# Altium project TcpControl.PrjPCB
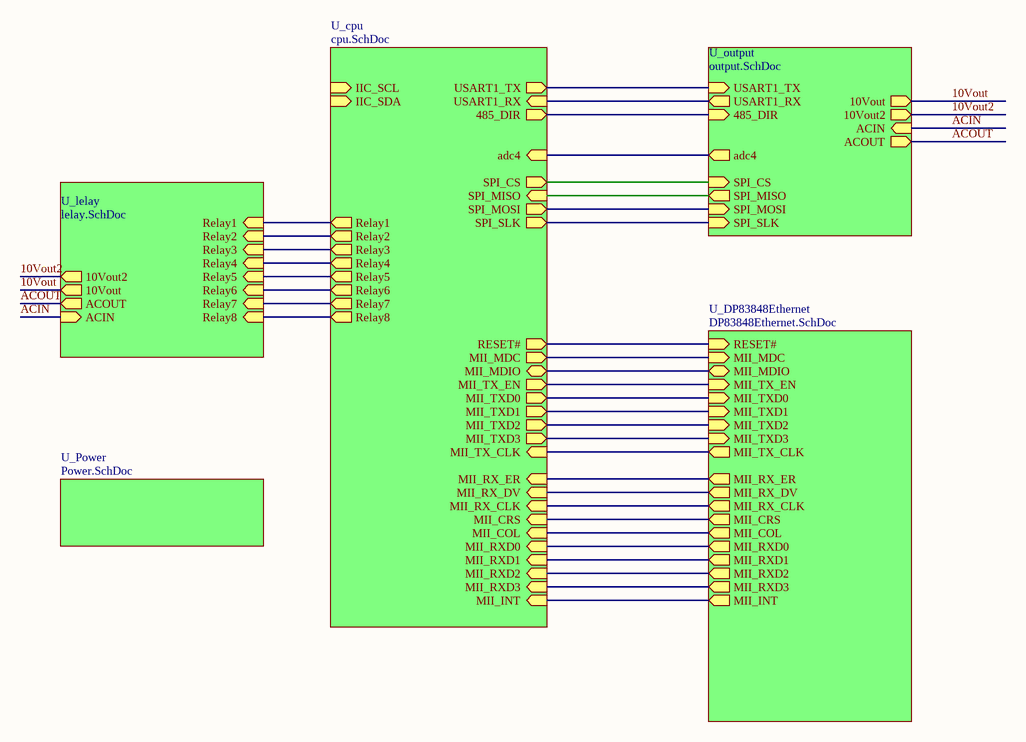
[diagram p0: tcpcontrol.SchDoc]
6 sheets, 221 parts. Net scope: hierarchical (ports join the sheet entries above them; power ports are global).
Board file: tcpcontrol.pcbdoc
Sheets:
  tcpcontrol.SchDoc
    U_cpu = cpu.SchDoc
    U_lelay = lelay.SchDoc
    U_output = output.SchDoc
    U_Power = Power.SchDoc
    U_DP83848Ethernet = DP83848Ethernet.SchDoc

## Sheet tcpcontrol.SchDoc
size A3; Organization: Altium Limited; Address1: L3, 12a Rodborough Rd; Address2: Frenchs Forest; Address3: NSW; Address4: Australia 2086

### Sub-sheets
U_cpu = cpu.SchDoc: USART1_TX (out), USART1_RX (in), Relay1 (out), Relay2 (out), 485_DIR (out), IIC_SCL (in), IIC_SDA (in), Relay3 (out), Relay4 (out), Relay8 (out), Relay7 (out), Relay5 (out), Relay6 (out), SPI_CS (out), SPI_MOSI (out), SPI_SLK (out), SPI_MISO (in), MII_TXD0 (out), MII_RX_ER (in), MII_RXD0 (in), MII_MDC (out), MII_MDIO (bidir), MII_RXD2 (in), MII_RX_DV (in), MII_TX_CLK (in), MII_TX_EN (out), MII_RXD3 (in), MII_RXD1 (in), MII_TXD3 (out), MII_INT (in), adc4 (in), RESET# (out), MII_CRS (in), MII_COL (in), MII_RX_CLK (in), MII_TXD1 (out), MII_TXD2 (out)
U_DP83848Ethernet = DP83848Ethernet.SchDoc: MII_TXD0 (in), MII_TX_EN (in), MII_TX_CLK (out), MII_RXD0 (out), MII_RX_ER (out), MII_RX_DV (out), MII_RX_CLK (out), MII_COL (out), MII_CRS (out), MII_MDC (in), MII_MDIO (bidir), RESET# (in), MII_TXD1 (in), MII_TXD2 (in), MII_TXD3 (in), MII_RXD1 (out), MII_RXD2 (out), MII_RXD3 (out), MII_INT (out)
U_lelay = lelay.SchDoc: Relay1 (in), Relay2 (in), Relay3 (in), Relay4 (in), Relay5 (in), Relay6 (in), Relay7 (in), Relay8 (in), 10Vout2 (out), 10Vout (out), ACOUT (out), ACIN (in)
U_output = output.SchDoc: USART1_TX (in), USART1_RX (out), 485_DIR (in), 10Vout2 (out), ACIN (in), ACOUT (out), 10Vout (out), SPI_CS (in), SPI_MISO (out), SPI_SLK (in), SPI_MOSI (in), adc4 (out)
U_Power = Power.SchDoc: no entries

### Nets
10Vout: sheet U_lelay/10Vout, sheet U_output/10Vout
10Vout2: sheet U_lelay/10Vout2, sheet U_output/10Vout2
ACIN: sheet U_lelay/ACIN, sheet U_output/ACIN  [project net 220_N]
ACOUT: sheet U_lelay/ACOUT, sheet U_output/ACOUT
NRST: sheet U_cpu/RESET#, sheet U_DP83848Ethernet/RESET#
PA0: sheet U_cpu/MII_CRS, sheet U_DP83848Ethernet/MII_CRS
PA1: sheet U_cpu/MII_RX_CLK, sheet U_DP83848Ethernet/MII_RX_CLK
PA2: sheet U_cpu/MII_MDIO, sheet U_DP83848Ethernet/MII_MDIO
PA3: sheet U_cpu/MII_COL, sheet U_DP83848Ethernet/MII_COL
PA4: sheet U_cpu/adc4, sheet U_output/adc4
PA5: sheet U_cpu/SPI_SLK, sheet U_output/SPI_SLK
PA6: sheet U_cpu/SPI_MISO, sheet U_output/SPI_MISO
PA7: sheet U_cpu/MII_RX_DV, sheet U_DP83848Ethernet/MII_RX_DV
PB0: sheet U_cpu/MII_RXD2, sheet U_DP83848Ethernet/MII_RXD2
PB1: sheet U_cpu/MII_RXD3, sheet U_DP83848Ethernet/MII_RXD3
PB5: sheet U_cpu/SPI_MOSI, sheet U_output/SPI_MOSI
PB6: sheet U_cpu/USART1_TX, sheet U_output/USART1_TX
PB7: sheet U_cpu/USART1_RX, sheet U_output/USART1_RX
PB8: sheet U_cpu/485_DIR, sheet U_output/485_DIR
PB10: sheet U_cpu/MII_RX_ER, sheet U_DP83848Ethernet/MII_RX_ER
PB11: sheet U_cpu/MII_TX_EN, sheet U_DP83848Ethernet/MII_TX_EN
PB12: sheet U_cpu/MII_TXD0, sheet U_DP83848Ethernet/MII_TXD0
PB13: sheet U_cpu/MII_TXD1, sheet U_DP83848Ethernet/MII_TXD1
PC1: sheet U_cpu/MII_MDC, sheet U_DP83848Ethernet/MII_MDC
PC2: sheet U_cpu/MII_TXD2, sheet U_DP83848Ethernet/MII_TXD2
PC3: sheet U_cpu/MII_TX_CLK, sheet U_DP83848Ethernet/MII_TX_CLK
PC4: sheet U_cpu/MII_RXD0, sheet U_DP83848Ethernet/MII_RXD0
PC5: sheet U_cpu/MII_RXD1, sheet U_DP83848Ethernet/MII_RXD1
PD0: sheet U_cpu/Relay5, sheet U_lelay/Relay5
PD1: sheet U_cpu/Relay6, sheet U_lelay/Relay6
PD2: sheet U_cpu/Relay7, sheet U_lelay/Relay7
PD3: sheet U_cpu/Relay8, sheet U_lelay/Relay8
PE2: sheet U_cpu/MII_TXD3, sheet U_DP83848Ethernet/MII_TXD3
PE10: sheet U_cpu/Relay4, sheet U_lelay/Relay4
PE11: sheet U_cpu/Relay3, sheet U_lelay/Relay3
PE12: sheet U_cpu/Relay2, sheet U_lelay/Relay2
PE13: sheet U_cpu/Relay1, sheet U_lelay/Relay1
PE15: sheet U_cpu/SPI_CS, sheet U_output/SPI_CS
NetR71_2: sheet U_cpu/MII_INT, sheet U_DP83848Ethernet/MII_INT

### Notes on the sheet
- Title
- Size:
- Date:
- A3
- Number:
- Time:
- Revision:
- Sheet
- of
- File:

## Sheet cpu.SchDoc
size A4
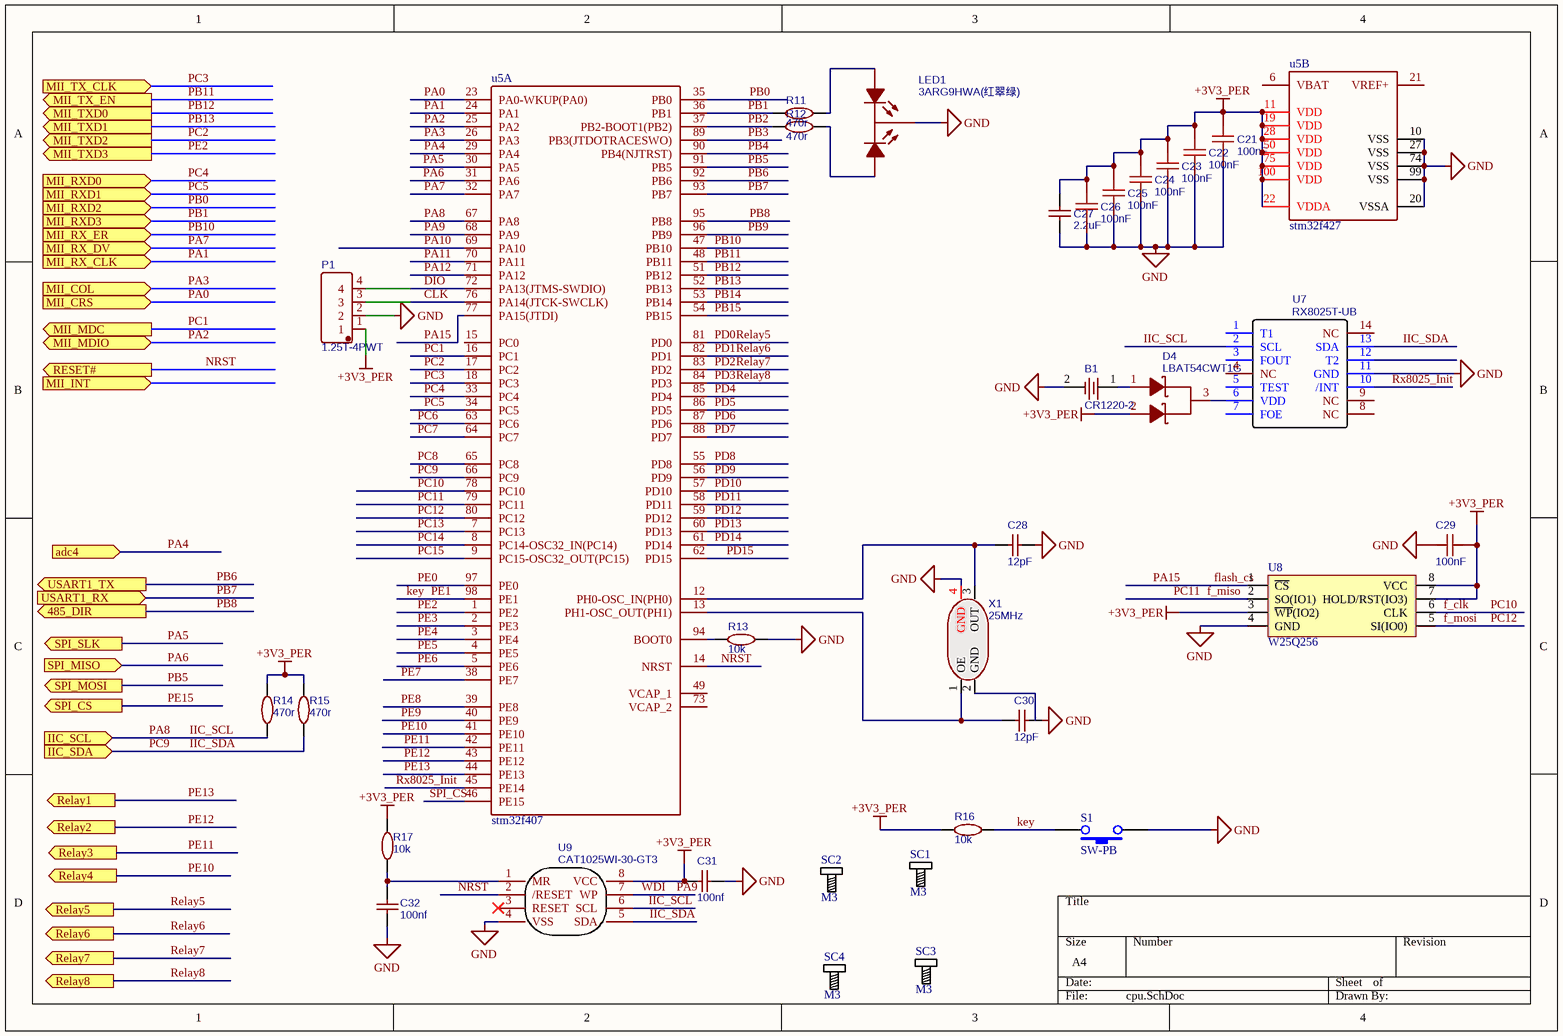
[diagram p1: cpu.SchDoc]

### Parts
B1  CR1220-2  [BATTERY-2]
C21  100nF  [0603 - cap]
C22  100nF  [0603 - cap]
C23  100nF  [0603 - cap]
C24  100nF  [0603 - cap]
C25  100nF  [0603 - cap]
C26  100nF  [0603 - cap]
C27  2.2uF  [1206 - cap]
C28  12pF  [0603 - cap]
C29  100nF  [0603 - cap]
C30  12pF  [0603 - cap]
C31  100nf  [0603 - cap]
C32  100nf  [0603 - cap]
D4  LBAT54CWT1G  [SC-70(SC-70-3)]
LED1  3ARG9HWA(红翠绿)  [led3]
P1  1.25T-4PWT  [1.25T-4PWT]
R11  470r  [0603-res]
R12  470r  [0603-res]
R13  10k  [0603-res]
R14  470r  [0603-res]
R15  470r  [0603-res]
R16  10k  [0603-res]
R17  10k  [0603-res]
S1  SW-PB  [HYA45513]
SC1  M3  [安装孔(3mm)]
SC2  M3  [安装孔(3mm)]
SC3  M3  [安装孔(3mm)]
SC4  M3  [安装孔(3mm)]
u5  stm32f407  [LQFP-100_14X14X05P]  (parts A,B of 2)
U7  RX8025T-UB  [SOP-14_208MIL]
U8  W25Q256  [LC-SOIC-8_208mil]
U9  CAT1025WI-30-GT3  [SOIC-8_150MIL]
X1  25MHz  [OSC-YSX-3225_4P]

### Ports
485_DIR (out), adc4 (in), IIC_SCL (in), IIC_SDA (in), MII_COL (in), MII_CRS (in), MII_INT (in), MII_MDC (out), MII_MDIO (bidir), MII_RX_CLK (in), MII_RX_DV (in), MII_RX_ER (in), MII_RXD0 (in), MII_RXD1 (in), MII_RXD2 (in), MII_RXD3 (in), MII_TX_CLK (in), MII_TX_EN (out), MII_TXD0 (out), MII_TXD1 (out), MII_TXD2 (out), MII_TXD3 (out), Relay1 (out), Relay2 (out), Relay3 (out), Relay4 (out), Relay5 (out), Relay6 (out), Relay7 (out), Relay8 (out), RESET# (out), SPI_CS (out), SPI_MISO (in), SPI_MOSI (out), SPI_SLK (out), USART1_RX (in), USART1_TX (out)

### Nets
+3V3_PER: C21.2 C22.2 C23.2 C24.2 C25.2 C26.2 C27.2 C29.1 C31.1 D4.2(K2) P1.1 R14.2 R15.2 R16.1 R17.2 u5.11(VDD) u5.19(VDD) u5.22(VDDA) u5.28(VDD) u5.50(VDD) u5.75(VDD) u5.100(VDD) U8.3(~{WP}(IO2)) U8.7(HOLD/RST(IO3)) U8.8(VCC) U9.8(VCC)
GND: B1.2 C21.1 C22.1 C23.1 C24.1 C25.1 C26.1 C27.1 C28.1 C29.2 C30.1 C31.2 C32.2 LED1.3(K) P1.2 R13.1 S1.1 u5.10(VSS) u5.20(VSSA) u5.27(VSS) u5.74(VSS) u5.99(VSS) U7.11(GND) U8.4(GND) U9.4(VSS) X1.4(GND)
CLK: P1.3 u5.76(PA14(JTCK-SWCLK))
DIO: P1.4 u5.72(PA13(JTMS-SWDIO))
f_clk: u5.78(PC10) U8.6(CLK)  [also labelled PC10]
f_miso: u5.79(PC11) U8.2(SO(IO1))  [also labelled PC11]
f_mosi: u5.80(PC12) U8.5(SI(IO0))  [also labelled PC12]
flash_cs: u5.77(PA15(JTDI)) U8.1(~{CS})  [also labelled PA15]
IIC_SCL: R14.1 u5.67(PA8) U7.2(SCL) U9.6(SCL) ; port IIC_SCL  [also labelled PA8]
IIC_SDA: R15.1 u5.66(PC9) U7.13(SDA) U9.5(SDA) ; port IIC_SDA  [also labelled PC9]
key: R16.2 S1.2 u5.98(PE1)  [also labelled PE1]
NRST: u5.14(NRST) U9.2(/RESET) ; port RESET#
PA0: u5.23(PA0-WKUP(PA0)) ; port MII_CRS
PA1: u5.24(PA1) ; port MII_RX_CLK
PA2: u5.25(PA2) ; port MII_MDIO
PA3: u5.26(PA3) ; port MII_COL
PA4: u5.29(PA4) ; port adc4
PA5: u5.30(PA5) ; port SPI_SLK
PA6: u5.31(PA6) ; port SPI_MISO
PA7: u5.32(PA7) ; port MII_RX_DV
PA9: u5.68(PA9) U9.7(WP)  [also labelled WDI]
PA10: u5.69(PA10)
PA11: u5.70(PA11)
PA12: u5.71(PA12)
PB0: u5.35(PB0) ; port MII_RXD2
PB1: R11.2 u5.36(PB1) ; port MII_RXD3
PB2: R12.2 u5.37(PB2-BOOT1(PB2))
PB3: u5.89(PB3(JTDOTRACESWO))
PB4: u5.90(PB4(NJTRST))
PB5: u5.91(PB5) ; port SPI_MOSI
PB6: u5.92(PB6) ; port USART1_TX
PB7: u5.93(PB7) ; port USART1_RX
PB8: u5.95(PB8) ; port 485_DIR
PB9: u5.96(PB9)
PB10: u5.47(PB10) ; port MII_RX_ER
PB11: u5.48(PB11) ; port MII_TX_EN
PB12: u5.51(PB12) ; port MII_TXD0
PB13: u5.52(PB13) ; port MII_TXD1
PB14: u5.53(PB14)
PB15: u5.54(PB15)
PC1: u5.16(PC1) ; port MII_MDC
PC2: u5.17(PC2) ; port MII_TXD2
PC3: u5.18(PC3) ; port MII_TX_CLK
PC4: u5.33(PC4) ; port MII_RXD0
PC5: u5.34(PC5) ; port MII_RXD1
PC6: u5.63(PC6)
PC7: u5.64(PC7)
PC8: u5.65(PC8)
PC13: u5.7(PC13)
PC14: u5.8(PC14-OSC32_IN(PC14))
PC15: u5.9(PC15-OSC32_OUT(PC15))
PD0: u5.81(PD0) ; port Relay5  [also labelled Relay5]
PD1: u5.82(PD1) ; port Relay6  [also labelled Relay6]
PD2: u5.83(PD2) ; port Relay7  [also labelled Relay7]
PD3: u5.84(PD3) ; port Relay8  [also labelled Relay8]
PD4: u5.85(PD4)
PD5: u5.86(PD5)
PD6: u5.87(PD6)
PD7: u5.88(PD7)
PD8: u5.55(PD8)
PD9: u5.56(PD9)
PD10: u5.57(PD10)
PD11: u5.58(PD11)
PD12: u5.59(PD12)
PD13: u5.60(PD13)
PD14: u5.61(PD14)
PD15: u5.62(PD15)
PE0: u5.97(PE0)
PE2: u5.1(PE2) ; port MII_TXD3
PE3: u5.2(PE3)
PE4: u5.3(PE4)
PE5: u5.4(PE5)
PE6: u5.5(PE6)
PE7: u5.38(PE7)
PE8: u5.39(PE8)
PE9: u5.40(PE9)
PE10: u5.41(PE10) ; port Relay4
PE11: u5.42(PE11) ; port Relay3
PE12: u5.43(PE12) ; port Relay2
PE13: u5.44(PE13) ; port Relay1
Rx8025_Init: u5.45(PE14) U7.10(/INT)
SPI_CS: u5.46(PE15)
NetB1_1: B1.1 D4.1(K1)
NetC28_2: C28.2 u5.12(PH0-OSC_IN(PH0)) X1.3(OUT)
NetC30_2: C30.2 u5.13(PH1-OSC_OUT(PH1)) X1.1(OE)
NetC32_1: C32.1 R17.1 U9.1(MR)
NetD4_3: D4.3(A) U7.6(VDD)
NetLED1_1: LED1.1(A1) R11.1
NetLED1_2: LED1.2(A2) R12.1
NetR13_2: R13.2 u5.94(BOOT0)

Not connected (* = marked no-connect by the designer): u5 6(VBAT) 15(PC0) 21(VREF+) 49(VCAP_1) 73(VCAP_2); U7 1(T1) 3(FOUT) 4(NC) 5(TEST) 7(FOE) 8(NC) 9(NC) 12(T2) 14(NC); U9 3(RESET)*; X1 2(GND)

### Library data of the parts
B1 = (no symbol name): BOM_Manufacturer: Q&J; BOM_Supplier: LCSC; BOM_Manufacturer Part: CR1220-2; BOM_LCSC: C70381; image: //image.lceda.cn/szlcsc/C70381.jpg; spicePre: B
C21-C26 C29 = (no symbol name): BOM_Manufacturer: YAGEO; BOM_Manufacturer Part: CC0603KRX7R9BB104; nameAlias: Capacitance; BOM_Supplier: LCSC; BOM_LCSC: C14663; BOM_LCSC Assembly: Yes; spicePre: C; spiceSymbolName: CC0603KRX7R9BB104
C27 = (no symbol name): BOM_Manufacturer Part: CL31B225KBHNNNE; BOM_Manufacturer: SAMSUNG; nameAlias: Capacitance; BOM_Supplier: LCSC; BOM_LCSC: C50254; BOM_LCSC Assembly: Yes; spicePre: C; spiceSymbolName: CL31B225KBHNNNE
C28 C30-C32 = (no symbol name): BOM_Manufacturer Part: CL10C120JB8NNNC; BOM_Manufacturer: SAMSUNG; nameAlias: Capacitance; BOM_Supplier: LCSC; BOM_LCSC: C38523; BOM_LCSC Assembly: Yes; spicePre: C; spiceSymbolName: CL10C120JB8NNNC
D4 = (no symbol name): BOM_Manufacturer: LRC; BOM_Supplier: LCSC; BOM_Manufacturer Part: LBAT54CWT1G; BOM_LCSC: C57891; image: //image.lceda.cn/szlcsc/C57891.jpg; spicePre: D
LED1 = (no symbol name): BOM_Manufacturer: KENTO; BOM_Supplier: LCSC; BOM_Manufacturer Part: 3ARG9HWA(红翠绿); BOM_LCSC: C72701; spicePre: L
P1 = (no symbol name): BOM_Manufacturer: BOOMELE; spicePre: X; BOM_Supplier: LCSC; BOM_LCSC: C31597; BOM_Manufacturer Part: 1.25T-4PWT
R11-R17 = (no symbol name): BOM_Manufacturer: UniOhm; BOM_Manufacturer Part: 0603WAF1001T5E; nameAlias: Value; BOM_Supplier: LCSC; BOM_LCSC: C21190; BOM_LCSC Assembly: Yes; spicePre: R; spiceSymbolName: 0603WAF1001T5E
S1 = SW-PB: 微型按键开关
SC1-SC4 = Screw_M3: Screw
u5 = stm32f427
U7 = (no symbol name): BOM_Manufacturer: EPSON; BOM_Supplier: LCSC; BOM_Manufacturer Part: RX8025T-UB; BOM_LCSC: C17353; image: //image.lceda.cn/szlcsc/C17353.jpg; spicePre: U
U8 = W25Q128
U9 = (no symbol name): BOM_Manufacturer: ON; BOM_Supplier: LCSC; BOM_Manufacturer Part: CAT1025WI-30-GT3; BOM_LCSC: C30752; image: //image.lceda.cn/szlcsc/C30752.jpg; spicePre: U
X1 = (no symbol name): BOM_Manufacturer: YXC; BOM_Manufacturer Part: X322525MOB4SI; nameAlias: Frequency; BOM_Supplier: LCSC; BOM_LCSC: C9006; BOM_LCSC Assembly: Yes; spicePre: X; spiceSymbolName: X322525MOB4SI

## Sheet lelay.SchDoc
size A3; Organization: Altium Limited; Address1: L3, 12a Rodborough Rd; Address2: Frenchs Forest; Address3: NSW; Address4: Australia 2086
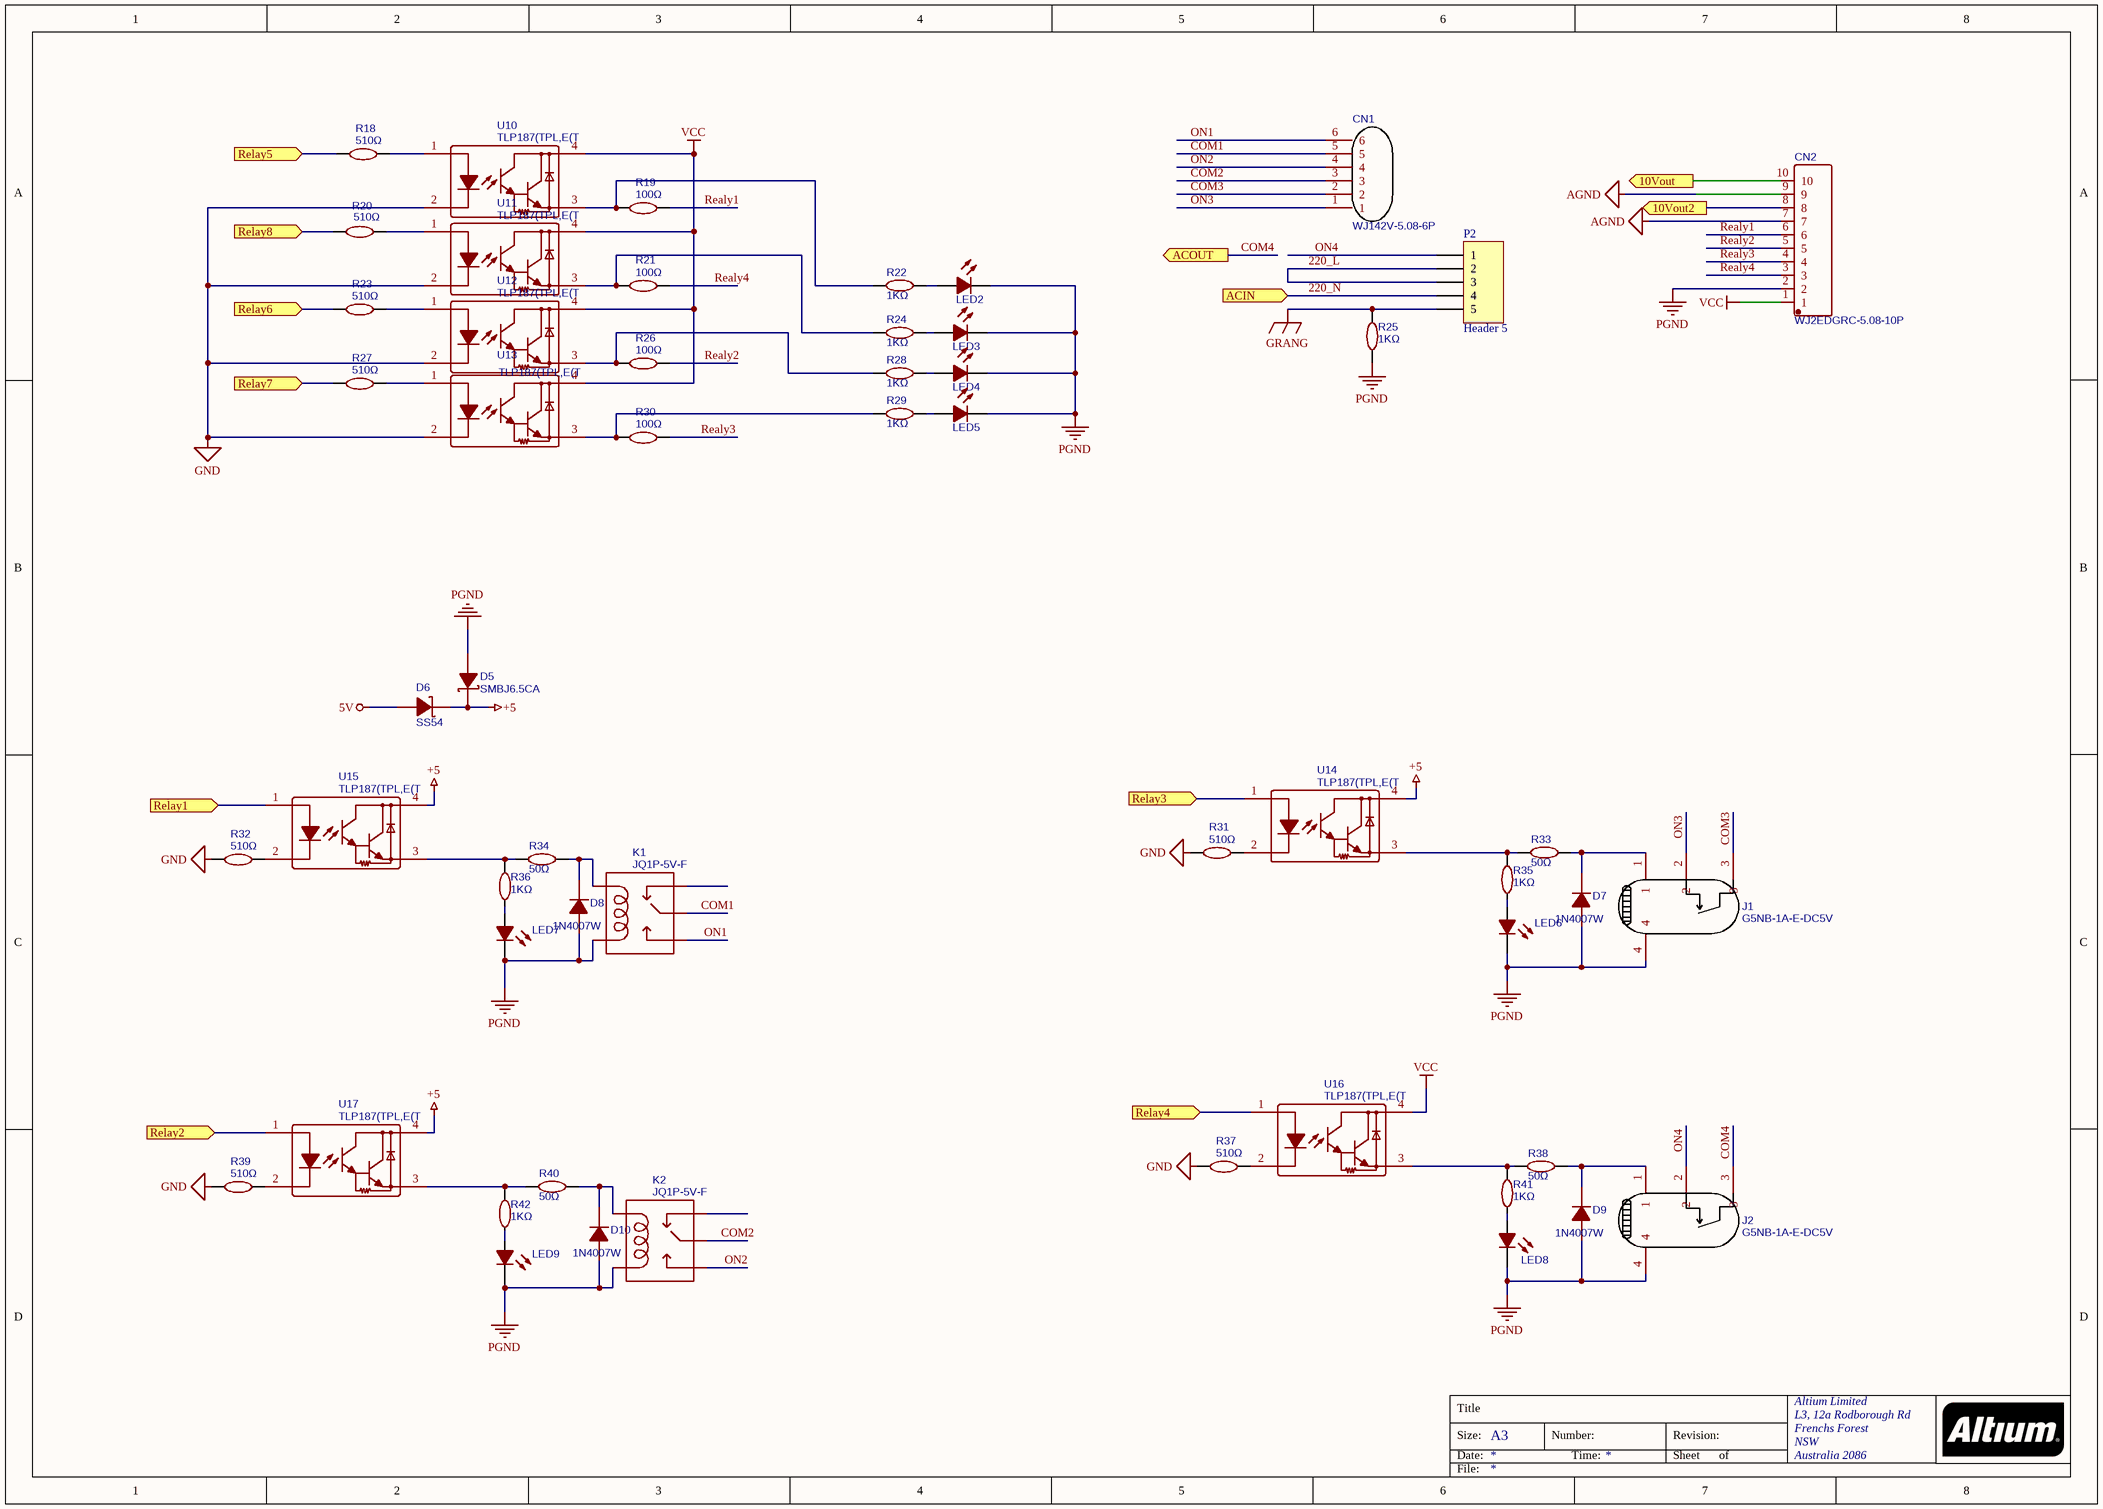
[diagram p2: lelay.SchDoc]

### Parts
CN1  WJ142V-5.08-6P  [5.08_6P]
CN2  WJ2EDGRC-5.08-10P  [WJ2EDGRC-5.08-10P]
D5  SMBJ6.5CA  [SMB(DO-214AA)]
D6  SS54  [SMA(DO-214AC)]
D7  1N4007W  [SOD-123FL]
D8  1N4007W  [SOD-123FL]
D9  1N4007W  [SOD-123FL]
D10  1N4007W  [SOD-123FL]
J1  G5NB-1A-E-DC5V  [G5NB-1A-E-DC5V]
J2  G5NB-1A-E-DC5V  [继电器]
K1  JQ1P-5V-F  [JQ1P-5V-F]
K2  JQ1P-5V-F  [JQ1P-5V-F]
LED2  19-217/GHC-YR1S2/3T  [LED-0603]  (value not drawn)
LED3  19-217/GHC-YR1S2/3T  [LED-0603]  (value not drawn)
LED4  19-217/GHC-YR1S2/3T  [LED-0603]  (value not drawn)
LED5  19-217/GHC-YR1S2/3T  [LED-0603]  (value not drawn)
LED6  19-217/GHC-YR1S2/3T  [LED-0603]  (value not drawn)
LED7  19-217/GHC-YR1S2/3T  [LED-0603]  (value not drawn)
LED8  19-217/GHC-YR1S2/3T  [LED-0603]  (value not drawn)
LED9  19-217/GHC-YR1S2/3T  [LED-0603]  (value not drawn)
P2  Header 5  [5p-7.62]
R18  510Ω  [0603-res]
R19  100Ω  [0603-res]
R20  510Ω  [0603-res]
R21  100Ω  [0603-res]
R22  1KΩ  [0603-res]
R23  510Ω  [0603-res]
R24  1KΩ  [0603-res]
R25  1KΩ  [0603-res]
R26  100Ω  [0603-res]
R27  510Ω  [0603-res]
R28  1KΩ  [0603-res]
R29  1KΩ  [0603-res]
R30  100Ω  [0603-res]
R31  510Ω  [0603-res]
R32  510Ω  [0603-res]
R33  50Ω  [0603-res]
R34  50Ω  [0603-res]
R35  1KΩ  [0603-res]
R36  1KΩ  [0603-res]
R37  510Ω  [0603-res]
R38  50Ω  [0603-res]
R39  510Ω  [0603-res]
R40  50Ω  [0603-res]
R41  1KΩ  [0603-res]
R42  1KΩ  [0603-res]
U10  TLP187(TPL,E(T  [TLP187]
U11  TLP187(TPL,E(T  [TLP187]
U12  TLP187(TPL,E(T  [TLP187]
U13  TLP187(TPL,E(T  [TLP187]
U14  TLP187(TPL,E(T  [TLP187]
U15  TLP187(TPL,E(T  [TLP187]
U16  TLP187(TPL,E(T  [TLP187]
U17  TLP187(TPL,E(T  [TLP187]

### Ports
10Vout2 (out), 10Vout (out), ACIN (in), ACOUT (out), Relay1 (in), Relay2 (in), Relay3 (in), Relay4 (in), Relay5 (in), Relay6 (in), Relay7 (in), Relay8 (in)

### Nets
5V: D6.1(A)
+5: D5.2 D6.2(K) U14.4 U15.4 U17.4
AGND: CN2.7 CN2.9
GND: R31.1 R32.1 R37.1 R39.1 U10.2 U11.2 U12.2 U13.2
GRANG: P2.5 R25.2
PGND: CN2.2 D5.1 D7.2(A) D8.2(A) D9.2(A) D10.2(A) J1.4 J2.4 K1.1 K2.1 LED2.2(C) LED3.2(C) LED4.2(C) LED5.2(C) LED6.2(C) LED7.2(C) LED8.2(C) LED9.2(C) R25.1
VCC: CN2.1 U10.4 U11.4 U12.4 U13.4 U16.4
10Vout: CN2.10 ; port 10Vout
10Vout2: CN2.8 ; port 10Vout2
220_L: P2.2 P2.3
220_N: P2.4 ; port ACIN
COM1: CN1.5 K1.4
COM2: CN1.3 K2.4
COM3: CN1.2 J1.3
COM4: J2.3 ; port ACOUT  [project net ACOUT]
ON1: CN1.6 K1.5
ON2: CN1.4 K2.5
ON3: CN1.1 J1.2
ON4: J2.2 P2.1
PD0: R18.1 ; port Relay5
PD1: R23.1 ; port Relay6
PD2: R27.1 ; port Relay7
PD3: R20.1 ; port Relay8
PE10: U16.1 ; port Relay4
PE11: U14.1 ; port Relay3
PE12: U17.1 ; port Relay2
PE13: U15.1 ; port Relay1
Realy1: CN2.6 R19.2
Realy2: CN2.5 R26.2
Realy3: CN2.4 R30.2
Realy4: CN2.3 R21.2
NetD7_1: D7.1(K) J1.1 R33.2
NetD8_1: D8.1(K) K1.2 R34.2
NetD9_1: D9.1(K) J2.1 R38.2
NetD10_1: D10.1(K) K2.2 R40.2
NetLED2_1: LED2.1(A) R22.2
NetLED3_1: LED3.1(A) R24.2
NetLED4_1: LED4.1(A) R28.2
NetLED5_1: LED5.1(A) R29.2
NetLED6_1: LED6.1(A) R35.2
NetLED7_1: LED7.1(A) R36.2
NetLED8_1: LED8.1(A) R41.2
NetLED9_1: LED9.1(A) R42.2
NetR18_2: R18.2 U10.1
NetR19_1: R19.1 R22.1 U10.3
NetR20_2: R20.2 U11.1
NetR21_1: R21.1 R24.1 U11.3
NetR23_2: R23.2 U12.1
NetR26_1: R26.1 R28.1 U12.3
NetR27_2: R27.2 U13.1
NetR29_1: R29.1 R30.1 U13.3
NetR31_2: R31.2 U14.2
NetR32_2: R32.2 U15.2
NetR33_1: R33.1 R35.1 U14.3
NetR34_1: R34.1 R36.1 U15.3
NetR37_2: R37.2 U16.2
NetR38_1: R38.1 R41.1 U16.3
NetR39_2: R39.2 U17.2
NetR40_1: R40.1 R42.1 U17.3

Not connected (* = marked no-connect by the designer): K1 3; K2 3

### Notes on the sheet
- Title
- Size:
- Date:
- A3
- Number:
- Time:
- Revision:
- Sheet
- of
- File:

### Library data of the parts
CN1 CN2 = (no symbol name): BOM_Manufacturer: ReliaPro; BOM_Supplier: LCSC; spicePre: C
  CN1: BOM_Manufacturer Part: WJ142V-5.08-6P; BOM_LCSC: C35897; image: //image.lceda.cn/szlcsc/C35897.jpg
  CN2: BOM_Manufacturer Part: WJ2EDGRC-5.08-10P; BOM_LCSC: C28429; image: //image.lceda.cn/szlcsc/C28429.jpg
D5 D6 = (no symbol name): BOM_Manufacturer: MDD; BOM_Supplier: LCSC; spicePre: D
  D5: BOM_Manufacturer Part: SMBJ6.5CA; BOM_LCSC: C113979
  D6: BOM_Manufacturer Part: SS54; BOM_LCSC: C22452; BOM_LCSC Assembly: Yes; image: //image.lceda.cn/szlcsc/C22452.jpg
D7-D10 = (no symbol name): BOM_Manufacturer: Jingdao; BOM_Supplier: LCSC; BOM_Manufacturer Part: 1N4007W; BOM_LCSC: C108803; spicePre: D
J1 J2 = (no symbol name): BOM_Manufacturer: OMRON; BOM_Supplier: LCSC; BOM_Manufacturer Part: G5NB-1A-E-DC5V; BOM_LCSC: C48746; image: //image.lceda.cn/szlcsc/C48746.jpg; spicePre: J
K1 K2 = (no symbol name): BOM_Manufacturer: PANASONIC; BOM_Supplier: LCSC; BOM_Manufacturer Part: JQ1P-5V-F; BOM_LCSC: C58271; spicePre: K
LED2-LED9 = (no symbol name): BOM_Manufacturer: EVERLIGHT; BOM_Supplier: LCSC; BOM_Manufacturer Part: 19-217/GHC-YR1S2/3T; BOM_LCSC: C72043; BOM_LCSC Assembly: Yes; image: //image.lceda.cn/szlcsc/C72043.jpg; spicePre: L
P2 = Header 5: Header, 5-Pin; LatestRevisionDate: 17-Jul-2002; LatestRevisionNote: Re-released for DXP Platform.; Publisher: Altium Limited
R18-R21 R23 R26 R27 R30-R32 R37 R39 = (no symbol name): BOM_Manufacturer: UniOhm; BOM_Manufacturer Part: 0603WAF5100T5E; nameAlias: Value; BOM_Supplier: LCSC; BOM_LCSC: C23193; BOM_LCSC Assembly: Yes; spicePre: R; spiceSymbolName: 0603WAF5100T5E
R22 R24 R25 R28 R29 R33-R36 R38 R40-R42 = (no symbol name): as R11 on sheet cpu; BOM_Supplier: LCSC; BOM_LCSC: C21190; BOM_LCSC Assembly: Yes; spicePre: R; spiceSymbolName: 0603WAF1001T5E
U10-U17 = (no symbol name): BOM_Manufacturer: TOSHIBA; BOM_Supplier: LCSC; BOM_Manufacturer Part: TLP187(TPL,E(T; BOM_LCSC: C50180; spicePre: U

## Sheet output.SchDoc
size A3; Organization: Altium Limited; Address1: L3, 12a Rodborough Rd; Address2: Frenchs Forest; Address3: NSW; Address4: Australia 2086
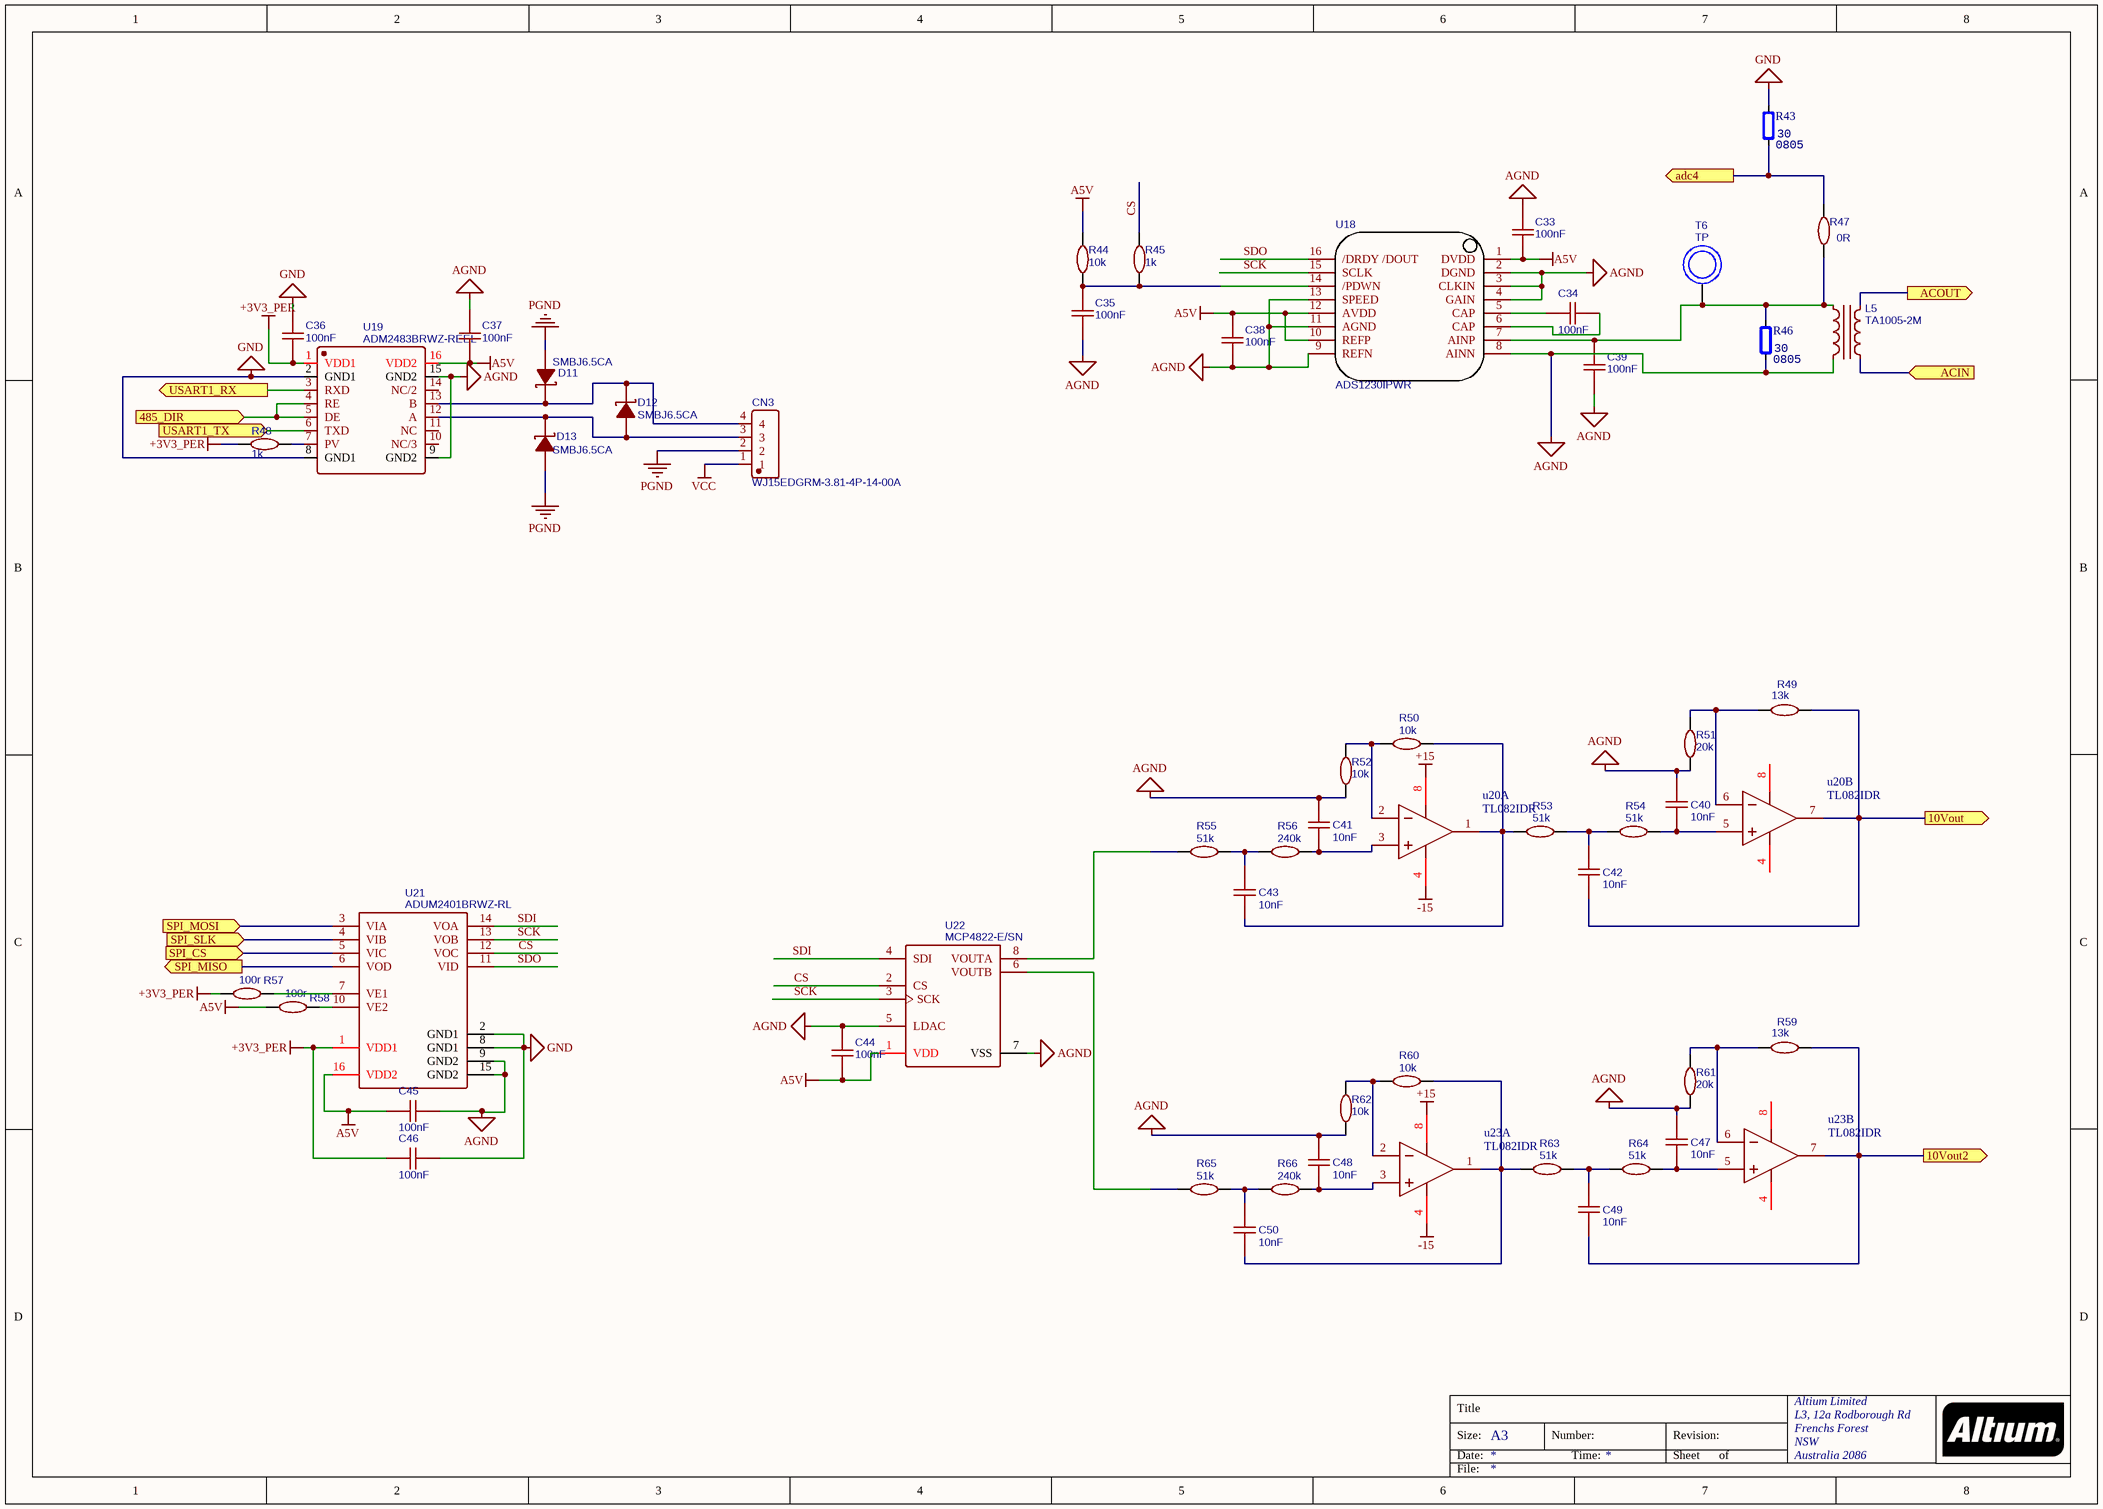
[diagram p3: output.SchDoc]

### Parts
C33  100nF  [0603 - cap]
C34  100nF  [0603 - cap]
C35  100nF  [0603 - cap]
C36  100nF  [0603 - cap]
C37  100nF  [0603 - cap]
C38  100nF  [0603 - cap]
C39  100nF  [0603 - cap]
C40  10nF  [0603 - cap]
C41  10nF  [0603 - cap]
C42  10nF  [0603 - cap]
C43  10nF  [0603 - cap]
C44  100nF  [0603 - cap]
C45  100nF  [0603 - cap]
C46  100nF  [0603 - cap]
C47  10nF  [0603 - cap]
C48  10nF  [0603 - cap]
C49  10nF  [0603 - cap]
C50  10nF  [0603 - cap]
CN3  WJ15EDGRM-3.81-4P-14-00A  [3.84-4p]
D11  SMBJ6.5CA  [SMB(DO-214AA)]
D12  SMBJ6.5CA  [SMB(DO-214AA)]
D13  SMBJ6.5CA  [SMB(DO-214AA)]
L5  TA1005-2M  [TA1005-2M]
R43  value 30  Type: 0805  [RES_0805]  (hidden comment: R0805)
R44  10k  [0603-res]
R45  1k  [0603-res]
R46  value 30  Type: 0805  [RES_0805]  (hidden comment: R0805)
R47  0R  [0603-res]
R48  1k  [0603-res]
R49  13k  [0603-res]
R50  10k  [0603-res]
R51  20k  [0603-res]
R52  10k  [0603-res]
R53  51k  [0603-res]
R54  51k  [0603-res]
R55  51k  [0603-res]
R56  240k  [0603-res]
R57  100r  [0603-res]
R58  100r  [0603-res]
R59  13k  [0603-res]
R60  10k  [0603-res]
R61  20k  [0603-res]
R62  10k  [0603-res]
R63  51k  [0603-res]
R64  51k  [0603-res]
R65  51k  [0603-res]
R66  240k  [0603-res]
T6  TP  [tp]
U18  ADS1230IPWR  [TSSOP-16]
U19  ADM2483BRWZ-REEL  [SOIC-16_300MIL]
u20  TL082IDR  [SOIC-8_150MIL]  (parts A,B of 2)
U21  ADUM2401BRWZ-RL  [SOIC-16_300MIL]
U22  MCP4822-E/SN  [SOIC-8_150MIL]
u23  TL082IDR  [SOIC-8_150MIL]  (parts A,B of 2)

### Ports
10Vout2 (out), 10Vout (out), 485_DIR (in), ACIN (in), ACOUT (out), adc4 (out), SPI_CS (in), SPI_MISO (out), SPI_MOSI (in), SPI_SLK (in), USART1_RX (out), USART1_TX (in)

### Nets
+3V3_PER: C36.2 C46.2 R48.1 R57.1 U19.1(VDD1) U21.1(VDD1)
+15: u20.8(VCC+) u23.8(VCC+)
-15: u20.4(VCC-) u23.4(VCC-)
A5V: C33.2 C37.2 C38.1 C44.2 C45.2 R44.2 R58.1 U18.1(DVDD) U18.10(REFP) U18.12(AVDD) U19.16(VDD2) U21.16(VDD2) U22.1(VDD)
AGND: C33.1 C35.2 C37.1 C38.2 C39.2 C40.2 C41.2 C44.1 C45.1 C47.2 C48.2 L5.4 R46.1 R51.1 R52.1 R61.1 R62.1 U18.2(DGND) U18.3(CLKIN) U18.4(GAIN) U18.8(AINN) U18.9(REFN) U18.11(AGND) U18.13(SPEED) U19.9(GND2) U19.15(GND2) U21.9(GND2) U21.15(GND2) U22.5(LDAC) U22.7(VSS)
GND: C36.1 C46.1 R43.2 U19.2(GND1) U19.8(GND1) U21.2(GND1) U21.8(GND1)
PGND: CN3.2 D11.1 D13.1
VCC: CN3.1
10Vout: C42.1 R49.2 u20.7(OUT2) ; port 10Vout
10Vout2: C49.1 R59.2 u23.7(OUT2) ; port 10Vout2
220_N: L5.1 ; port ACIN
ACOUT: L5.2 ; port ACOUT
CS: R45.2 U21.12(VOC) U22.2(CS)
PA4: R43.1 R47.2 ; port adc4
PA5: U21.4(VIB) ; port SPI_SLK
PA6: U21.6(VOD) ; port SPI_MISO
PB5: U21.3(VIA) ; port SPI_MOSI
PB6: U19.6(TXD) ; port USART1_TX
PB7: U19.3(RXD) ; port USART1_RX
PB8: U19.4(RE) U19.5(DE) ; port 485_DIR
PE15: U21.5(VIC) ; port SPI_CS
SCK: U18.15(SCLK) U21.13(VOB) U22.3(SCK)
SDI: U21.14(VOA) U22.4(SDI)
SDO: U18.16(/DRDY_/DOUT) U21.11(VID)
NetC34_1: C34.1 U18.5(CAP)
NetC34_2: C34.2 U18.6(CAP)
NetC35_1: C35.1 R44.1 R45.1 U18.14(/PDWN)
NetC39_1: C39.1 L5.3 R46.2 R47.1 T6.1 U18.7(AINP)
NetC40_1: C40.1 R54.2 u20.5(IN2+)
NetC41_1: C41.1 R56.2 u20.3(IN1+)
NetC42_2: C42.2 R53.2 R54.1
NetC43_1: C43.1 R50.2 R53.1 u20.1(OUT1)
NetC43_2: C43.2 R55.2 R56.1
NetC47_1: C47.1 R64.2 u23.5(IN2+)
NetC48_1: C48.1 R66.2 u23.3(IN1+)
NetC49_2: C49.2 R63.2 R64.1
NetC50_1: C50.1 R60.2 R63.1 u23.1(OUT1)
NetC50_2: C50.2 R65.2 R66.1
NetCN3_3: CN3.3 D12.1 D13.2 U19.12(A)
NetCN3_4: CN3.4 D11.2 D12.2 U19.13(B)
NetR48_2: R48.2 U19.7(PV)
NetR49_1: R49.1 R51.2 u20.6(IN2-)
NetR50_1: R50.1 R52.2 u20.2(IN1-)
NetR55_1: R55.1 U22.8(VOUTA)
NetR57_2: R57.2 U21.7(VE1)
NetR58_2: R58.2 U21.10(VE2)
NetR59_1: R59.1 R61.2 u23.6(IN2-)
NetR60_1: R60.1 R62.2 u23.2(IN1-)
NetR65_1: R65.1 U22.6(VOUTB)

Not connected (* = marked no-connect by the designer): U19 10(NC/3) 11(NC) 14(NC/2)

### Notes on the sheet
- Title
- Size:
- Date:
- A3
- Number:
- Time:
- Revision:
- Sheet
- of
- File:

### Library data of the parts
C33-C50 = (no symbol name): as C21 on sheet cpu; BOM_Supplier: LCSC; BOM_LCSC: C14663; BOM_LCSC Assembly: Yes; spicePre: C; spiceSymbolName: CC0603KRX7R9BB104
CN3 = (no symbol name): BOM_Manufacturer: ReliaPro; Contributor: LCSC; BOM_Supplier: LCSC; BOM_LCSC: C160127; BOM_Manufacturer Part: WJ15EDGRM-3.81-4P-14-00A; spicePre: C
D11-D13 = (no symbol name): BOM_Manufacturer: MDD; BOM_Supplier: LCSC; BOM_Manufacturer Part: SMBJ6.5CA; BOM_LCSC: C113979; spicePre: D
L5 = (no symbol name): BOM_Manufacturer: TSFAR; nameAlias: Value; BOM_Supplier: LCSC; BOM_Manufacturer Part: TA1005-2M; BOM_LCSC: C128247; spicePre: L; spiceSymbolName: TA1005-2M
R43 R46 = Res_0805: Resistor; Specification: ±5%; Manufacturer: *
R44 R45 R47-R66 = (no symbol name): as R11 on sheet cpu; BOM_Supplier: LCSC; BOM_LCSC: C21190; BOM_LCSC Assembly: Yes; spicePre: R; spiceSymbolName: 0603WAF1001T5E
U18 = (no symbol name): BOM_Manufacturer: TI; BOM_Supplier: LCSC; BOM_Manufacturer Part: ADS1230IPWR; BOM_LCSC: C58052; image: //image.lceda.cn/szlcsc/C58052.jpg; spicePre: U
U19 U21 = (no symbol name): BOM_Manufacturer: ADI; BOM_Supplier: LCSC; spicePre: U
  U19: BOM_Manufacturer Part: ADM2483BRWZ-REEL; BOM_LCSC: C9637; BOM_LCSC Assembly: Yes; image: //image.lceda.cn/szlcsc/C9637.jpg
  U21: BOM_Manufacturer Part: ADUM2401BRWZ-RL; BOM_LCSC: C18965; image: //image.lceda.cn/szlcsc/C18965.jpg
u20 u23 = tl802t
U22 = (no symbol name): BOM_Manufacturer: MICROCHIP; BOM_Supplier: LCSC; BOM_Manufacturer Part: MCP4822-E/SN; BOM_LCSC: C16040; spicePre: U
T6 = (no symbol name): BOM_Manufacturer Part: ?; spicePre: T

## Sheet Power.SchDoc
size A4
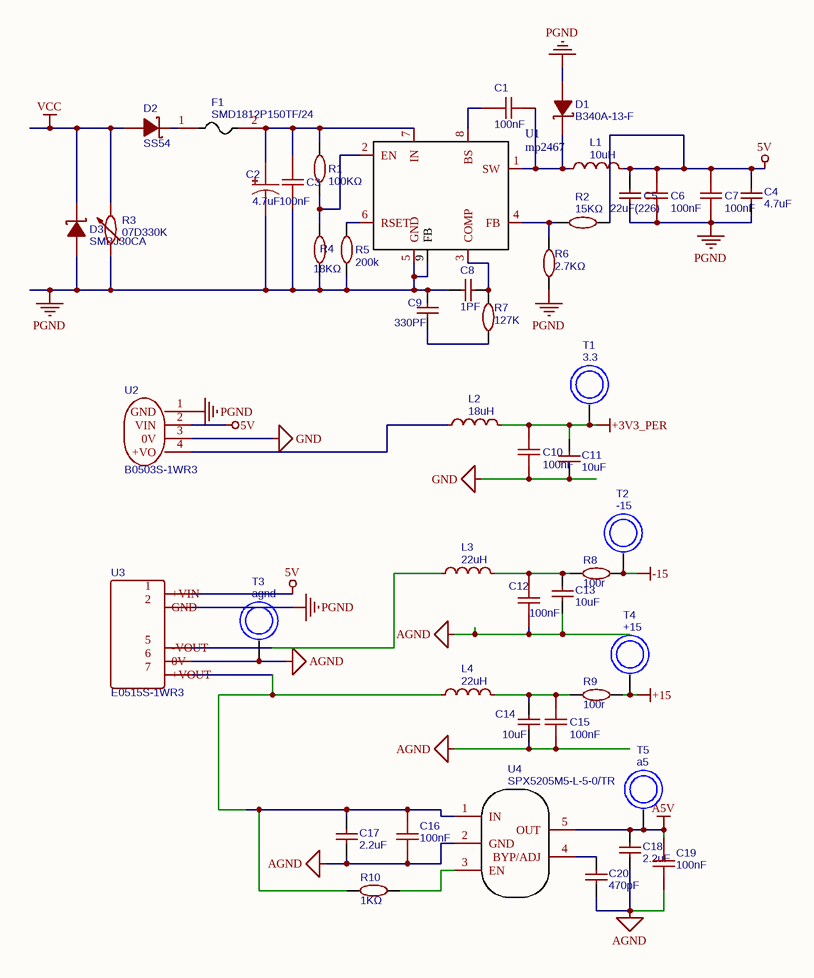
[diagram p4: Power.SchDoc]

### Parts
C1  100nF  [0603 - cap]
C2  4.7uF  [CAP-6.3*5.4]
C3  100nF  [0603 - cap]
C4  4.7uF  [1206 - cap]
C5  22uF(226)  [1206 - cap]
C6  100nF  [0603 - cap]
C7  100nF  [0603 - cap]
C8  1PF  [0603 - cap]
C9  330PF  [0603 - cap]
C10  100nF  [0603 - cap]
C11  10uF  [1206 - cap]
C12  100nF  [0603 - cap]
C13  10uF  [1206 - cap]
C14  10uF  [1206 - cap]
C15  100nF  [0603 - cap]
C16  100nF  [0603 - cap]
C17  2.2uF  [1206 - cap]
C18  2.2uF  [1206 - cap]
C19  100nF  [0603 - cap]
C20  470pF  [0603 - cap]
D1  B340A-13-F  [SMA(DO-214AC)]
D2  SS54  [SMA(DO-214AC)]
D3  SMBJ30CA  [SMB(DO-214AA)]
F1  SMD1812P150TF/24  [1812]
L1  10uH  [8040]
L2  18uH  [1220]
L3  22uH  [IND_0805]
L4  22uH  [IND_0805]
R1  100KΩ  [0603-res]
R2  15KΩ  [0603-res]
R3  07D330K  [PS-RES-9*4.7]
R4  18KΩ  [0603-res]
R5  200k  [0603-res]
R6  2.7KΩ  [0603-res]
R7  127K  [0603-res]
R8  100r  [1206-res]
R9  100r  [1206-res]
R10  1KΩ  [0603-res]
T1  3.3  [tp]
T2  -15  [tp]
T3  agnd  [tp]
T4  +15  [tp]
T5  a5  [tp]
U1  mp2467  [ESOP-8-EP]
U2  B0503S-1WR3  [B0505S-1WR2]
U3  E0515S-1WR3  [E0515S-1WR3]
U4  SPX5205M5-L-5-0/TR  [SOT-23-5]

### Nets
5V: C4.2 C5.2 C6.2 C7.2 L1.2 R2.2 U2.2(VIN) U3.1(+VIN)
+3V3_PER: C10.2 C11.1 L2.2 T1.1
+15: R9.2 T4.1
-15: R8.2 T2.1
A5V: C18.2 C19.2 T5.1 U4.5(OUT)
AGND: C12.1 C13.2 C14.2 C15.1 C16.2 C17.2 C18.1 C19.1 C20.1 T3.1 U3.6(0V) U4.2(GND)
GND: C10.1 C11.2 U2.3(0V)
PGND: C2.2 C3.1 C4.1 C5.1 C6.1 C7.1 C8.2 C9.2 D1.1(A) D3.1(A) R3.1 R4.1 R5.1 R6.1 U1.5(GND) U1.9(FB) U2.1(GND) U3.2(GND)
VCC: D2.1(A) D3.2(K) R3.2
NetC1_1: C1.1 D1.2(K) L1.1 U1.1(SW)
NetC1_2: C1.2 U1.8(BS)
NetC2_1: C2.1 C3.2 F1.2 R1.2 U1.7(IN)
NetC8_1: C8.1 R7.2 U1.3(COMP)
NetC9_1: C9.1 R7.1
NetC12_2: C12.2 C13.1 L3.2 R8.1
NetC14_1: C14.1 C15.2 L4.2 R9.1
NetC16_1: C16.1 C17.1 L4.1 R10.1 U3.7(+VOUT) U4.1(IN)
NetC20_2: C20.2 U4.4(BYP/ADJ)
NetD2_2: D2.2(K) F1.1
NetL2_1: L2.1 U2.4(+VO)
NetL3_1: L3.1 U3.5(-VOUT)
NetR1_1: R1.1 R4.2 U1.2(EN)
NetR2_1: R2.1 R6.2 U1.4(FB)
NetR5_2: R5.2 U1.6(RSET)
NetR10_2: R10.2 U4.3(EN)

### Library data of the parts
C1 C3 C6 C7 C10 C12 C15 C16 C19 = (no symbol name): as C21 on sheet cpu; BOM_Supplier: LCSC; BOM_LCSC: C14663; BOM_LCSC Assembly: Yes; spicePre: C; spiceSymbolName: CC0603KRX7R9BB104
C2 = (no symbol name): BOM_Manufacturer: HONOR; BOM_Manufacturer Part: RVT2A4R7M0605; nameAlias: Capacitance; BOM_Supplier: LCSC; BOM_LCSC: C87856; spicePre: C; spiceSymbolName: RVT2A4R7M0605
C4 = (no symbol name): BOM_Manufacturer: FH; BOM_Manufacturer Part: 1206B475K500NT; nameAlias: Capacitance; BOM_Supplier: LCSC; BOM_LCSC: C29823; BOM_LCSC Assembly: Yes; spicePre: C; spiceSymbolName: 1206B475K500NT
C5 = (no symbol name): BOM_Manufacturer: FH; BOM_Manufacturer Part: 1206F226M100NT; nameAlias: Value; Contributor: LCSC; BOM_Supplier: LCSC; BOM_LCSC: C108718; spicePre: C; spiceSymbolName: 1206F226M100NT
C8 C9 = (no symbol name): BOM_Manufacturer: FH; BOM_Manufacturer Part: 0603B472K500NT; nameAlias: Capacitance; BOM_Supplier: LCSC; BOM_LCSC: C53987; BOM_LCSC Assembly: Yes; spicePre: C; spiceSymbolName: 0603B472K500NT
C11 C13 C14 C17 C18 = (no symbol name): as C27 on sheet cpu; BOM_Supplier: LCSC; BOM_LCSC: C50254; BOM_LCSC Assembly: Yes; spicePre: C; spiceSymbolName: CL31B225KBHNNNE
C20 = (no symbol name): BOM_Manufacturer: FH; BOM_Manufacturer Part: 0603B471K500NT; nameAlias: Capacitance; BOM_Supplier: LCSC; BOM_LCSC: C1620; BOM_LCSC Assembly: Yes; spicePre: C; spiceSymbolName: 0603B471K500NT
D1 = (no symbol name): BOM_Manufacturer: DIODES; BOM_Supplier: LCSC; BOM_Manufacturer Part: B340A-13-F; BOM_LCSC: C85098; spicePre: D
D2 D3 = (no symbol name): BOM_Manufacturer: MDD; BOM_Supplier: LCSC; spicePre: D
  D2: BOM_Manufacturer Part: SS54; BOM_LCSC: C22452; BOM_LCSC Assembly: Yes; image: //image.lceda.cn/szlcsc/C22452.jpg
  D3: BOM_Manufacturer Part: SMBJ30CA; BOM_LCSC: C113999
F1 = (no symbol name): BOM_Manufacturer: RUILON; BOM_Supplier: LCSC; BOM_Manufacturer Part: SMD1812P150TF/24; BOM_LCSC: C32404; image: //image.lceda.cn/szlcsc/C32404.jpg; spicePre: F
L1 L3 L4 = (no symbol name): BOM_Manufacturer: TDK; BOM_Manufacturer Part: VLP8040T-100M; nameAlias: Inductance; BOM_Supplier: LCSC; BOM_LCSC: C107345; spicePre: L; spiceSymbolName: VLP8040T-100M
L2 = (no symbol name): BOM_Manufacturer: Sunlord; BOM_Manufacturer Part: SPH252012H180MT; nameAlias: Inductance; BOM_Supplier: LCSC; BOM_LCSC: C98384; spicePre: L; spiceSymbolName: SPH252012H180MT
R1 = (no symbol name): BOM_Manufacturer: UniOhm; BOM_Manufacturer Part: 0603WAF1003T5E; nameAlias: Value; BOM_Supplier: LCSC; BOM_LCSC: C25803; BOM_LCSC Assembly: Yes; spicePre: R; spiceSymbolName: 0603WAF1003T5E
R2 R6 R10 = (no symbol name): BOM_Manufacturer: UniOhm; BOM_Manufacturer Part: 0603WAF2002T5E; nameAlias: Value; BOM_Supplier: LCSC; BOM_LCSC: C4184; BOM_LCSC Assembly: Yes; spicePre: R; spiceSymbolName: 0603WAF2002T5E
R3 = (no symbol name): BOM_Manufacturer: RUILON; nameAlias: Value; BOM_Supplier: LCSC; BOM_Manufacturer Part: 07D330K; BOM_LCSC: C26299; spicePre: R; spiceSymbolName: 07D330K
R4 R5 = (no symbol name): BOM_Manufacturer: UniOhm; BOM_Manufacturer Part: 0603WAF1502T5E; nameAlias: Value; BOM_Supplier: LCSC; BOM_LCSC: C22809; BOM_LCSC Assembly: Yes; spicePre: R; spiceSymbolName: 0603WAF1502T5E
R7 = (no symbol name): BOM_Manufacturer: UniOhm; BOM_Manufacturer Part: 0603WAF1302T5E; nameAlias: Resistance (Ohms); BOM_Supplier: LCSC; BOM_LCSC: C22797; BOM_LCSC Assembly: Yes; spicePre: R; spiceSymbolName: 0603WAF1302T5E
R8 R9 = (no symbol name): as R11 on sheet cpu; BOM_Supplier: LCSC; BOM_LCSC: C21190; BOM_LCSC Assembly: Yes; spicePre: R; spiceSymbolName: 0603WAF1001T5E
U2 U3 = (no symbol name): BOM_Manufacturer: MORNSUN; BOM_Supplier: LCSC; spicePre: U
  U2: BOM_Manufacturer Part: B0503S-1WR3; BOM_LCSC: C131168
  U3: BOM_Manufacturer Part: E0515S-1WR3; BOM_LCSC: C131169
U4 = (no symbol name): BOM_Manufacturer: EXAR; BOM_Supplier: LCSC; BOM_Manufacturer Part: SPX5205M5-L-5-0/TR; BOM_LCSC: C6865; image: //image.lceda.cn/szlcsc/C6865.jpg; spicePre: U
T1-T5 = (no symbol name): BOM_Manufacturer Part: ?; spicePre: T

## Sheet DP83848Ethernet.SchDoc
size A4; Revision: B.2(PCB.SCH)
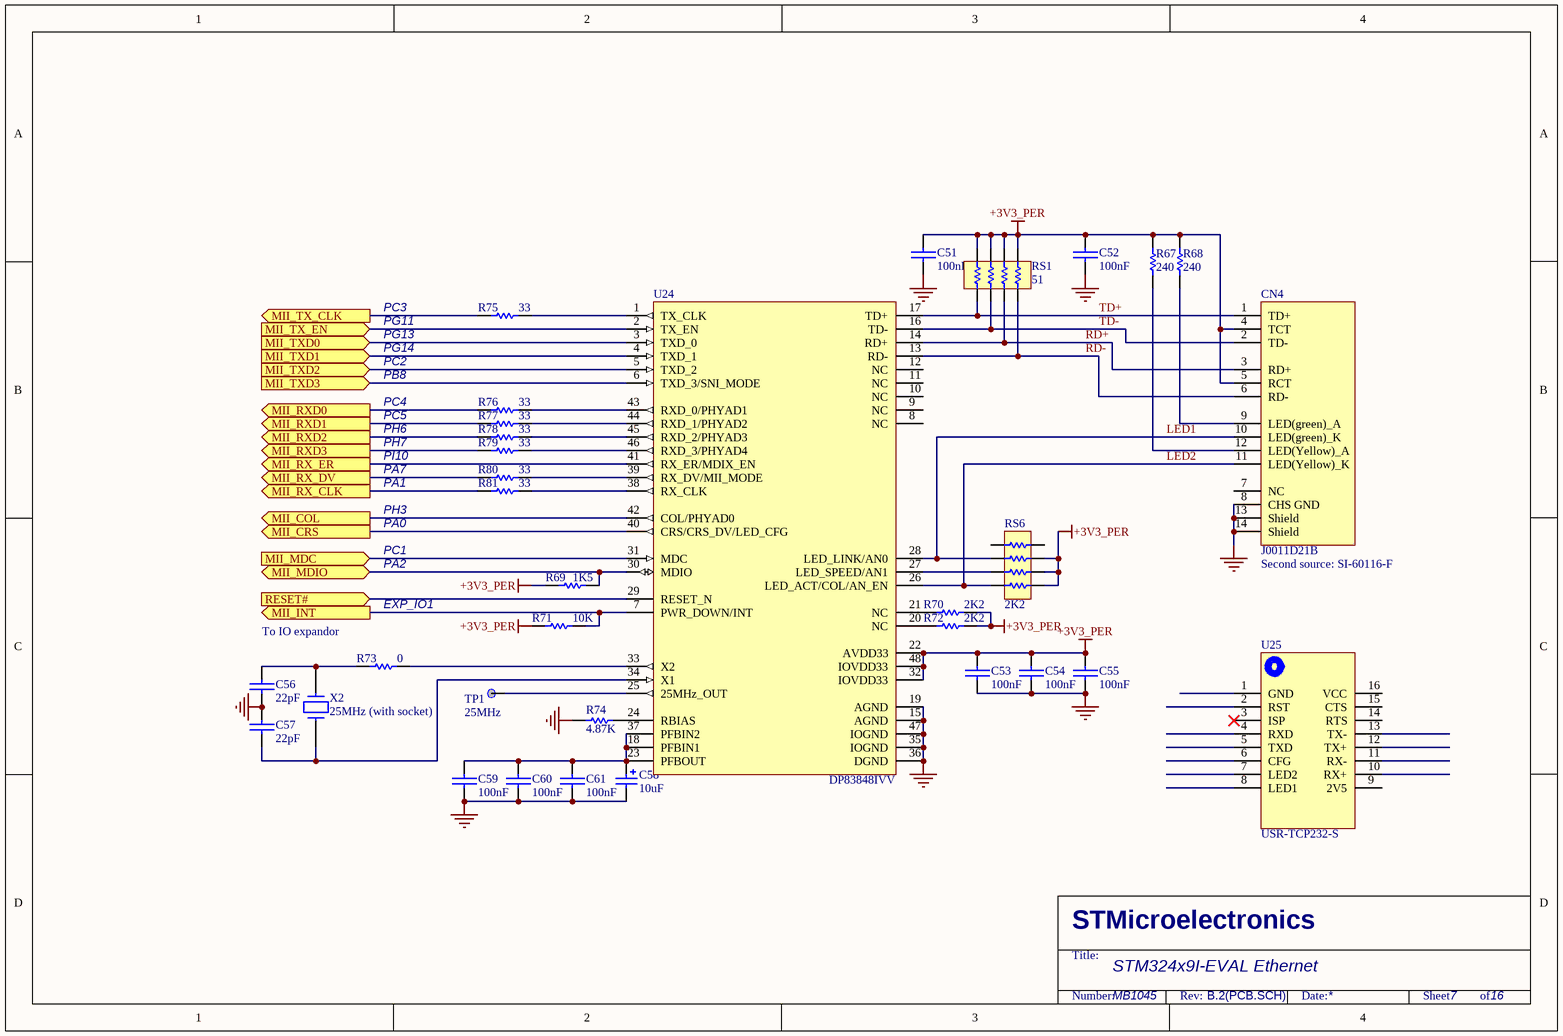
[diagram p5: DP83848Ethernet.SchDoc]

### Parts
C51  100nF  [CAP_0603]
C52  100nF  [CAP_0603]
C53  100nF  [CAP_0603]
C54  100nF  [CAP_0603]
C55  100nF  [CAP_0603]
C56  22pF  [CAP_0603]
C57  22pF  [CAP_0603]
C58  10uF  [CAP_TAN_A1206]
C59  100nF  [CAP_0603]
C60  100nF  [CAP_0603]
C61  100nF  [CAP_0603]
CN4  J0011D21B  [RJ45]
R67  240  [RES_0603]
R68  240  [RES_0603]
R69  1K5  [RES_0603]
R70  2K2  [RES_0603]
R71  10K  [RES_0603]
R72  2K2  [RES_0603]
R73  0  [RES_0603]
R74  4.87K  [RES_0603]
R75  33  [RES_0603]
R76  33  [RES_0603]
R77  33  [RES_0603]
R78  33  [RES_0603]
R79  33  [RES_0603]
R80  33  [RES_0603]
R81  33  [RES_0603]
RS1  51  [LC-0603_Rx4]
RS6  2K2  [LC-0603_Rx4]
TP1  25MHz  [TP]
U24  DP83848IVV  [LC-LQFP-48_7x7x05P]
U25  USR-TCP232-S  [USR-TCP232-S]
X2  25MHz (with socket)  [OSC-YSX-3225_4P]

### Ports
MII_COL (out), MII_CRS (out), MII_INT (out), MII_MDC (in), MII_MDIO (bidir), MII_RX_CLK (out), MII_RX_DV (out), MII_RX_ER (out), MII_RXD0 (out), MII_RXD1 (out), MII_RXD2 (out), MII_RXD3 (out), MII_TX_CLK (out), MII_TX_EN (in), MII_TXD0 (in), MII_TXD1 (in), MII_TXD2 (in), MII_TXD3 (in), RESET# (in)

### Nets
+3V3_PER: C51.2 C52.2 C53.1 C54.2 C55.2 CN4.4(TCT) CN4.5(RCT) R67.2 R68.2 R69.2 R70.2 R71.1 R72.2 RS1.2 RS1.4 RS1.6 RS1.8 RS6.1 RS6.3 RS6.5 U24.22(AVDD33) U24.32(IOVDD33) U24.48(IOVDD33)
GND: C51.1 C52.1 C53.2 C54.1 C55.1 C56.1 C57.2 C58.2 C59.2 C60.1 C61.1 CN4.8(CHS_GND) CN4.13(Shield) CN4.14(Shield) R74.1 U24.15(AGND) U24.19(AGND) U24.35(IOGND) U24.36(DGND) U24.47(IOGND)
LED1: CN4.10(LED(green)_K) RS6.6 U24.28(LED_LINK/AN0)
LED2: CN4.11(LED(Yellow)_K) RS6.2 U24.26(LED_ACT/COL/AN_EN)
NRST: U24.29(RESET_N) ; port RESET#
PA0: U24.40(CRS/CRS_DV/LED_CFG) ; port MII_CRS
PA1: R81.2 ; port MII_RX_CLK
PA2: R69.1 U24.30(MDIO) ; port MII_MDIO
PA3: U24.42(COL/PHYAD0) ; port MII_COL
PA7: R80.2 ; port MII_RX_DV
PB0: R78.2 ; port MII_RXD2
PB1: R79.2 ; port MII_RXD3
PB10: U24.41(RX_ER/MDIX_EN) ; port MII_RX_ER
PB11: U24.2(TX_EN) ; port MII_TX_EN
PB12: U24.3(TXD_0) ; port MII_TXD0
PB13: U24.4(TXD_1) ; port MII_TXD1
PC1: U24.31(MDC) ; port MII_MDC
PC2: U24.5(TXD_2) ; port MII_TXD2
PC3: R75.2 ; port MII_TX_CLK
PC4: R76.2 ; port MII_RXD0
PC5: R77.2 ; port MII_RXD1
PE2: U24.6(TXD_3/SNI_MODE) ; port MII_TXD3
RD+: CN4.3(RD+) RS1.5 U24.14(RD+)
RD-: CN4.6(RD-) RS1.7 U24.13(RD-)
TD+: CN4.1(TD+) RS1.1 U24.17(TD+)
TD-: CN4.2(TD-) RS1.3 U24.16(TD-)
NetC56_2: C56.2 R73.2 X2.2
NetC57_1: C57.1 U24.34(X1) X2.1
NetC58_1: C58.1 C59.1 C60.2 C61.2 U24.18(PFBIN1) U24.23(PFBOUT) U24.37(PFBIN2)
NetCN4_9: CN4.9(LED(green)_A) R68.1
NetCN4_12: CN4.12(LED(Yellow)_A) R67.1
NetR70_1: R70.1 U24.21(NC)
NetR71_2: R71.2 U24.7(PWR_DOWN/INT) ; port MII_INT
NetR72_1: R72.1 U24.20(NC)
NetR73_1: R73.1 U24.33(X2)
NetR74_2: R74.2 U24.24(RBIAS)
NetR75_1: R75.1 U24.1(TX_CLK)
NetR76_1: R76.1 U24.43(RXD_0/PHYAD1)
NetR77_1: R77.1 U24.44(RXD_1/PHYAD2)
NetR78_1: R78.1 U24.45(RXD_2/PHYAD3)
NetR79_1: R79.1 U24.46(RXD_3/PHYAD4)
NetR80_1: R80.1 U24.39(RX_DV/MII_MODE)
NetR81_1: R81.1 U24.38(RX_CLK)
NetRS6_4: RS6.4 U24.27(LED_SPEED/AN1)
NetTP1_1: TP1.1 U24.25(25MHz_OUT)

Not connected (* = marked no-connect by the designer): CN4 7(NC); RS6 7 8; U24 8(NC) 9(NC) 10(NC) 11(NC) 12(NC); U25 1(GND) 2(RST) 3(ISP)* 4(RXD) 5(TXD) 6(CFG) 7(LED2) 8(LED1) 9(2V5) 10(RX+) 11(RX-) 12(TX+) 13(TX-) 14(RTS) 15(CTS) 16(VCC)

### Notes on the sheet
- PC3
- PG11
- PG13
- PG14
- PC2
- PB8
- PC4
- PC5
- PH6
- PH7
- PI10
- PA7
- PH3
- PA1
- PA0
- PC1
- PA2
- (near CN4) Second source: SI-60116-F
- To IO expandor
- EXP_IO1
- STM324x9I-EVAL Ethernet
- MB1045
- 7
- 16
- STMicroelectronics
- Title:
- Number:
- Rev:
- Date:
- Sheet          of

### Library data of the parts
C51-C57 C59-C61 = CAP: Capacitor
C58 = Cap Pol1: Polarized Capacitor (Radial); Published: 8-Jun-2000; Revision: July-2002: Re-released for DXP Platform.; Publisher: Altium Limited; Value: 10uF
R67-R81 = Res1: Resistor; Value: 1K; Published: 8-Jun-2000; Revision: July-2002: Re-released for DXP Platform.; Publisher: Altium Limited
RS1 RS6 = Resister Array
TP1 = TP
U24 = DP83848CVV
X2 = CRYSTAL

## Nets that join several sheets
5V: lelay (D6.1), Power (8 pins)
+3V3_PER: cpu (26 pins), output (6 pins), Power (C10.2 C11.1 L2.2 T1.1), DP83848Ethernet (23 pins)
+15: output (u20.8 u23.8), Power (R9.2 T4.1)
-15: output (u20.4 u23.4), Power (R8.2 T2.1)
A5V: output (13 pins), Power (C18.2 C19.2 T5.1 U4.5)
AGND: lelay (CN2.7 CN2.9), output (30 pins), Power (12 pins)
GND: cpu (26 pins), lelay (8 pins), output (7 pins), Power (C10.1 C11.2 U2.3), DP83848Ethernet (20 pins)
PGND: lelay (19 pins), output (CN3.2 D11.1 D13.1), Power (18 pins)
VCC: lelay (6 pins), output (CN3.1), Power (D2.1 D3.2 R3.2)
10Vout: lelay (CN2.10), output (C42.1 R49.2 u20.7)
10Vout2: lelay (CN2.8), output (C49.1 R59.2 u23.7)
220_N: lelay (P2.4), output (L5.1)
ACOUT: lelay (J2.3), output (L5.2)
NRST: cpu (u5.14 U9.2), DP83848Ethernet (U24.29)
PA0: cpu (u5.23), DP83848Ethernet (U24.40)
PA1: cpu (u5.24), DP83848Ethernet (R81.2)
PA2: cpu (u5.25), DP83848Ethernet (R69.1 U24.30)
PA3: cpu (u5.26), DP83848Ethernet (U24.42)
PA4: cpu (u5.29), output (R43.1 R47.2)
PA5: cpu (u5.30), output (U21.4)
PA6: cpu (u5.31), output (U21.6)
PA7: cpu (u5.32), DP83848Ethernet (R80.2)
PB0: cpu (u5.35), DP83848Ethernet (R78.2)
PB1: cpu (R11.2 u5.36), DP83848Ethernet (R79.2)
PB5: cpu (u5.91), output (U21.3)
PB6: cpu (u5.92), output (U19.6)
PB7: cpu (u5.93), output (U19.3)
PB8: cpu (u5.95), output (U19.4 U19.5)
PB10: cpu (u5.47), DP83848Ethernet (U24.41)
PB11: cpu (u5.48), DP83848Ethernet (U24.2)
PB12: cpu (u5.51), DP83848Ethernet (U24.3)
PB13: cpu (u5.52), DP83848Ethernet (U24.4)
PC1: cpu (u5.16), DP83848Ethernet (U24.31)
PC2: cpu (u5.17), DP83848Ethernet (U24.5)
PC3: cpu (u5.18), DP83848Ethernet (R75.2)
PC4: cpu (u5.33), DP83848Ethernet (R76.2)
PC5: cpu (u5.34), DP83848Ethernet (R77.2)
PD0: cpu (u5.81), lelay (R18.1)
PD1: cpu (u5.82), lelay (R23.1)
PD2: cpu (u5.83), lelay (R27.1)
PD3: cpu (u5.84), lelay (R20.1)
PE2: cpu (u5.1), DP83848Ethernet (U24.6)
PE10: cpu (u5.41), lelay (U16.1)
PE11: cpu (u5.42), lelay (U14.1)
PE12: cpu (u5.43), lelay (U17.1)
PE13: cpu (u5.44), lelay (U15.1)